# Altium project lcdRGB.PrjPcb
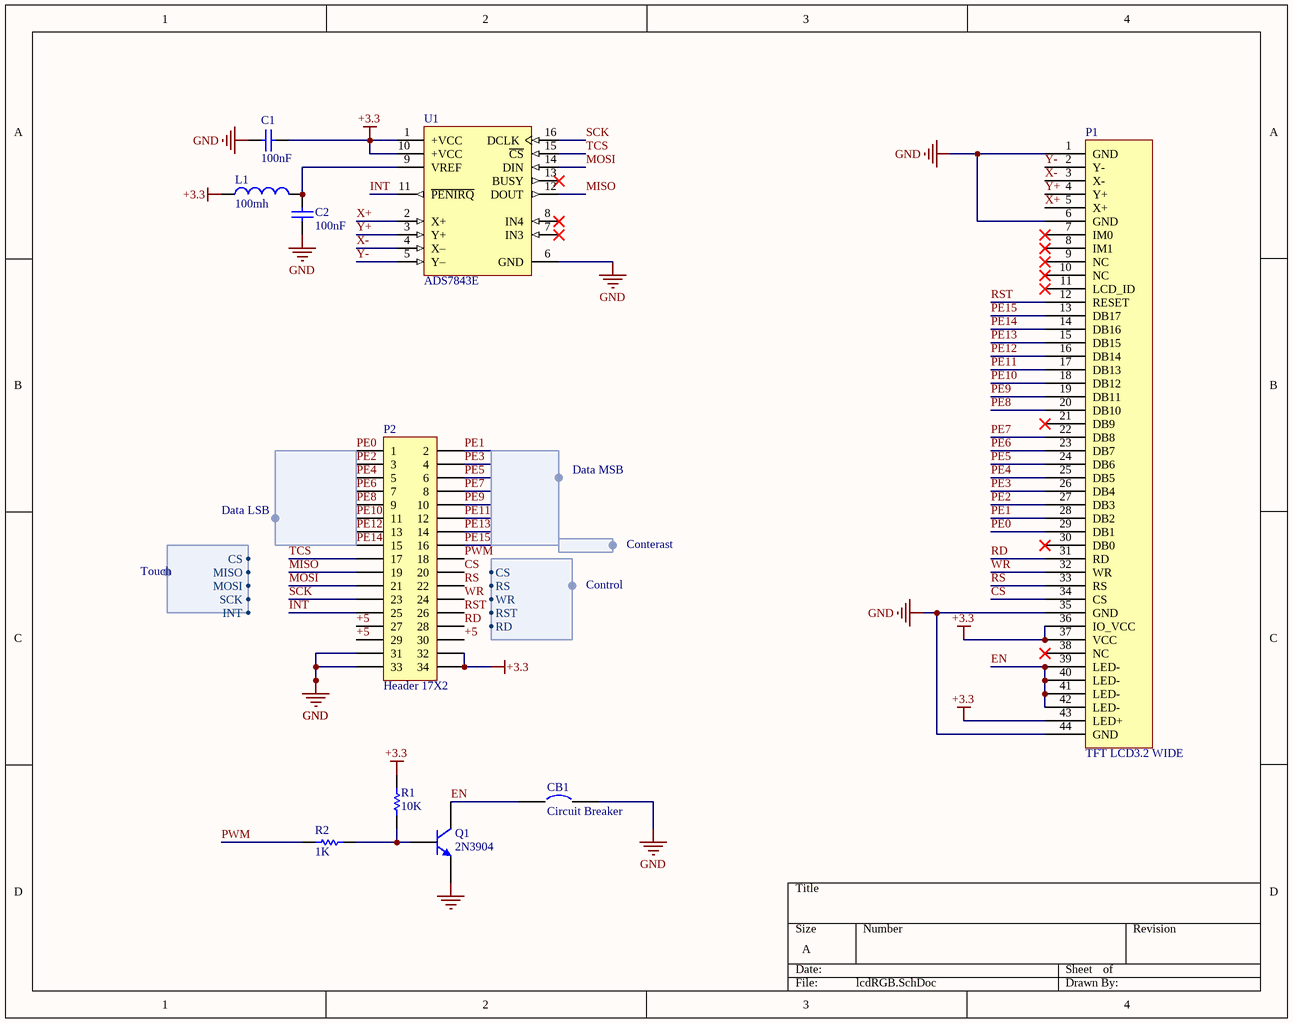
[diagram p0: lcdRGB.SchDoc]
1 sheet, 10 parts. Net scope: global (net labels, ports and power ports of the same name join across sheets).
Board file: lcdRGB.PcbDoc

## Sheet lcdRGB.SchDoc
size A

### Parts
C1  100nF  [1206]
C2  100nF  [1206]
CB1  Circuit Breaker  [0603c]
L1  100mh  [1206]
P1  TFT LCD3.2 WIDE  [FPC44]
P2  Header 17X2  [IDC34S]
Q1  2N3904  [BCY-W3/E4]
R1  10K  [1206]
R2  1K  [1206]
U1  ADS7843E  [DBQ016]

### Harnesses
Data LSB: 
Data MSB: 
Conterast: 
Touch: CS, MISO, MOSI, SCK, INT
Control: CS, RST, RD, WR, RS

### Nets
+3.3: C1.2 L1.1 P1.36(IO_VCC) P1.37(VCC) P1.43(LED+) P2.32 P2.34 R1.2 U1.1(+VCC) U1.10(+VCC)
GND: C1.1 C2.1 CB1.2 P1.1(GND) P1.6(GND) P1.35(GND) P1.44(GND) P2.31 P2.33 Q1.1(E) U1.6(GND)
+5: P2.27 P2.29 P2.30
CS: P1.34(CS) P2.20
EN: CB1.1 P1.39(LED-) P1.40(LED-) P1.41(LED-) P1.42(LED-) Q1.3(C)
INT: P2.25 U1.11(~{PENIRQ})
MISO: P2.19 U1.12(DOUT)
MOSI: P2.21 U1.14(DIN)
PE0: P1.29(DB1) P2.1
PE1: P1.28(DB2) P2.2
PE2: P1.27(DB3) P2.3
PE3: P1.26(DB4) P2.4
PE4: P1.25(DB5) P2.5
PE5: P1.24(DB6) P2.6
PE6: P1.23(DB7) P2.7
PE7: P1.22(DB8) P2.8
PE8: P1.20(DB10) P2.9
PE9: P1.19(DB11) P2.10
PE10: P1.18(DB12) P2.11
PE11: P1.17(DB13) P2.12
PE12: P1.16(DB14) P2.13
PE13: P1.15(DB15) P2.14
PE14: P1.14(DB16) P2.15
PE15: P1.13(DB17) P2.16
PWM: P2.18 R2.2
RD: P1.31(RD) P2.28
RS: P1.33(RS) P2.22
RST: P1.12(RESET) P2.26
SCK: P2.23 U1.16(DCLK)
TCS: P2.17 U1.15(~{CS})
WR: P1.32(WR) P2.24
X+: P1.5(X+) U1.2(X+)
X-: P1.3(X-) U1.4(X–)
Y+: P1.4(Y+) U1.3(Y+)
Y-: P1.2(Y-) U1.5(Y–)
NetC2_2: C2.2 L1.2 U1.9(VREF)
NetQ1_2: Q1.2(B) R1.1 R2.1

Not connected (* = marked no-connect by the designer): P1 7(IM0)* 8(IM1)* 9(NC)* 10(NC)* 11(LCD_ID)* 21(DB9)* 30(DB0)* 38(NC)*; U1 7(IN3)* 8(IN4)* 13(BUSY)*

### Library data of the parts
C1 C2 = Cap: Capacitor; Published: 8-Jun-2000; Revision: July-2002: Re-released for DXP Platform.; Publisher: Altium Limited; Value: 100nF
L1 = Inductor: Code_IEC: 1005; Value: 10mH; Published: 8-Jun-2000; LatestRevisionDate: 29-May-2009; LatestRevisionNote: IPC-7351 Footprint Added.; PackageReference: 0402-A; Publisher: Altium Limited; PackageDescription: Chip Inductor; Code_JEITA: 0402
P1 = TFTLCD3.2
P2 = Header 17X2: Header, 17-Pin, Dual row; LatestRevisionDate: 17-Jul-2002; LatestRevisionNote: Re-released for DXP Platform.; Publisher: Altium Limited
Q1 = 2N3904: NPN General Purpose Amplifier; Published: 8-Jun-2000; LatestRevisionDate: 15-Jan-2003; LatestRevisionNote: PCB Footprint 'BCY-W3/D4.7' replaced; DatasheetVersion: 1997; PackageVersion: Sep-1998; PackageReference: TO-92A; Publisher: Altium Limited; Code_JEDEC: TO-92A; ComponentLink1Description: Manufacturer Link; ComponentLink1URL: http://www.fairchildsemi.com/; ComponentLink2Description: Datasheet; ComponentLink2URL: http://www.fairchildsemi.com/ds/2N%2F2N3904.pdf
R1 = Res Semi: Semiconductor Resistor; Value: 10R; Published: 8-Jun-2000; LatestRevisionDate: 17-Jul-2002; LatestRevisionNote: Re-released for DXP Platform.; PackageReference: AXIAL-0.5; Publisher: Altium Limited
R2 = Res Semi: Semiconductor Resistor; Published: 8-Jun-2000; LatestRevisionDate: 17-Jul-2002; LatestRevisionNote: Re-released for DXP Platform.; PackageReference: AXIAL-0.5; Publisher: Altium Limited; Value: 1K
U1 = ADS7843E: 4-Wire Touch Screen Controller, 16-Pin SSOP, Pb-Free; Published: 6-Oct-2005; DatasheetVersion: May-2002; PackageVersion: Feb-2005; PackageReference: DBQ016; Publisher: Altium Limited; PackageDescription: SSOP; 16 Leads; Body Width 3.9 mm; Pitch 0.635 mm; Code_JEDEC: MO-137-AB; ComponentLink1Description: Manufacturer Link; ComponentLink1URL: http://focus.ti.com/docs/prod/folders/print/ads7843.html; ComponentLink2Description: Datasheet; ComponentLink2URL: http://focus.ti.com/lit/ds/symlink/ads7843.pdf
CB1 = Circuit Breaker: Published: 24-Mar-1999; LatestRevisionDate: 17-Jul-2002; LatestRevisionNote: Re-released for DXP Platform.; PackageReference: SPST-2; Publisher: Altium Limited; PackageDescription: Switch; 2 Leads